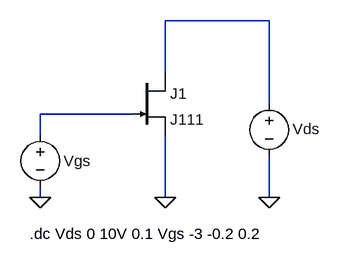
[diagram p0: schematic ID_vs_UDS-1.asc]
ID_vs_UDS-1.asc, the LTspice schematic file:
Version 4
SHEET 1 1292 680
WIRE -560 -144 -720 -144
WIRE -720 -64 -720 -144
WIRE -560 -16 -560 -144
WIRE -768 0 -912 0
WIRE -912 32 -912 0
WIRE -912 128 -912 112
WIRE -720 128 -720 32
WIRE -560 128 -560 64
FLAG -560 128 0
FLAG -912 128 0
FLAG -720 128 0
SYMBOL voltage -560 -32 R0
WINDOW 123 0 0 Left 2
WINDOW 39 37 60 Left 2
WINDOW 0 36 55 Left 2
WINDOW 3 37 60 Left 2
SYMATTR InstName Vds
SYMATTR Value ""
SYMBOL voltage -912 16 R0
WINDOW 123 0 0 Left 2
WINDOW 39 40 53 Left 2
WINDOW 3 40 69 Left 2
WINDOW 0 36 56 Left 2
SYMATTR Value ""
SYMATTR InstName Vgs
SYMBOL njf -768 -64 R0
SYMATTR InstName J1
SYMATTR Value J111
TEXT -928 184 Left 2 !.dc Vds 0 10V 0.1 Vgs -3 -0.2 0.2

The netlist it stands for:
* ID_vs_UDS-1.asc
Vds N001 0
Vgs N002 0
J1 N001 N002 0 J111
.model NJF NJF
.model PJF PJF
.lib standard.jft
.dc Vds 0 10V 0.1 Vgs -3 -0.2 0.2
.backanno
.end